# EAGLE design usb-serie (EAGLE 4.09)
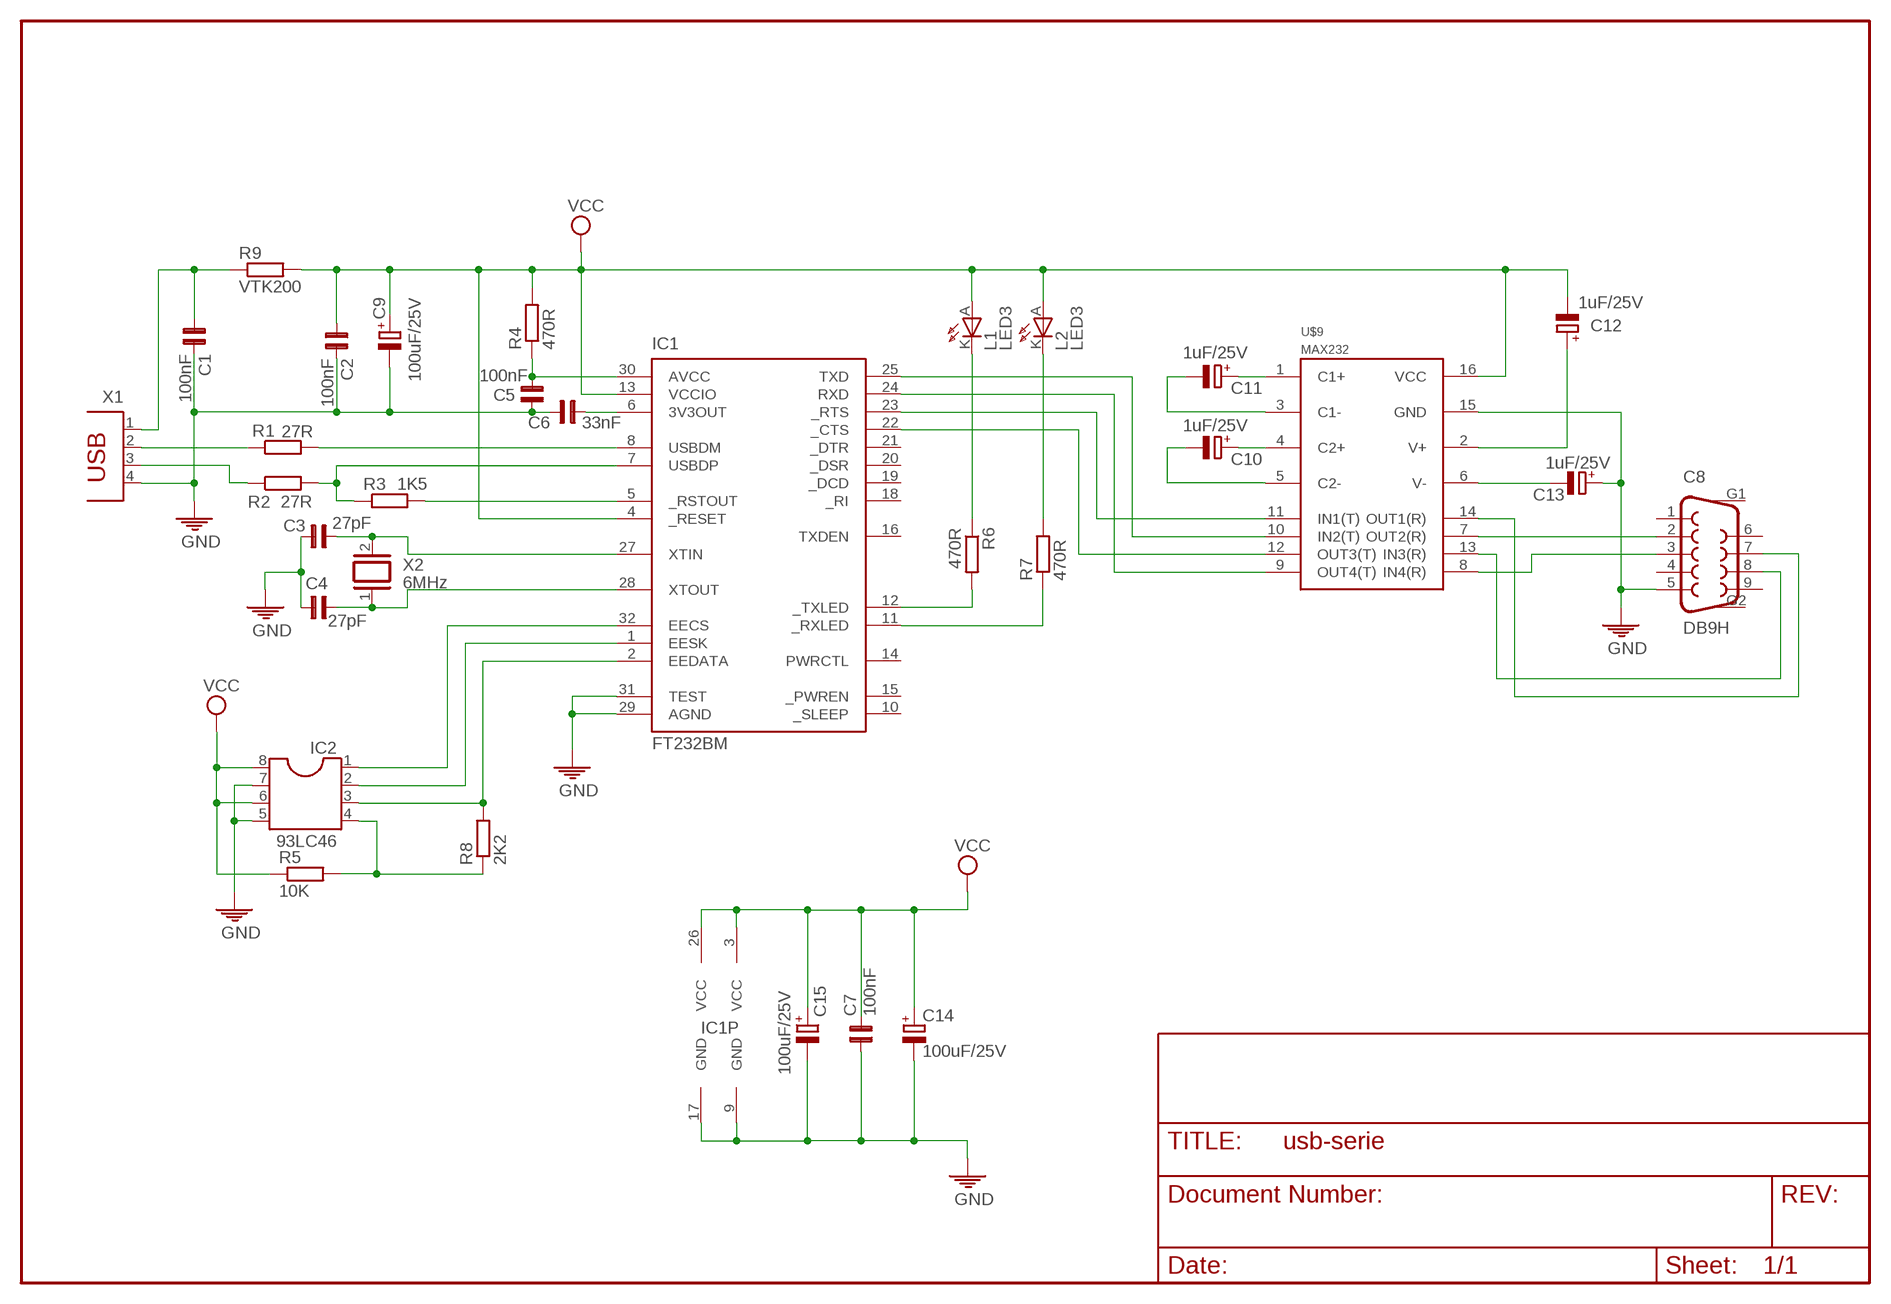
[diagram p0: schematic, sheet 1]

## Parts
C1  100nF  CON-MUL5  [C5]
C2  100nF  CON-MUL5  [C5]
C3  27pF  CON-MUL5  [C5]
C4  27pF  CON-MUL5  [C5]
C5  100nF  CON-MUL5  [C5]
C6  33nF  CON-MUL5  [C5]
C7  100nF  CON-MUL5  [C5]
C8  DB9H  [DB9H]
C9  100uF/25V  CPOL-EUE2.5-6  [E2,5-6]
C10  1uF/25V  CPOL-EUE2.5-6  [E2,5-6]
C11  1uF/25V  CPOL-EUE2.5-6  [E2,5-6]
C12  1uF/25V  CPOL-EUE2.5-6  [E2,5-6]
C13  1uF/25V  CPOL-EUE2.5-6  [E2,5-6]
C14  100uF/25V  CPOL-EUE2.5-6  [E2,5-6]
C15  100uF/25V  CPOL-EUE2.5-6  [E2,5-6]
IC1  FT232BM  [LQFP32]
IC2  93LC46  DIL8  [DIL08]
L1  LED3  [LED3MM]
L2  LED3  [LED3MM]
R1  27R  RESISTENCIA10  [R207/10]
R2  27R  RESISTENCIA10  [R207/10]
R3  1K5  RESISTENCIA10  [R207/10]
R4  470R  RESISTENCIA10  [R207/10]
R5  10K  RESISTENCIA10  [R207/10]
R6  470R  RESISTENCIA10  [R207/10]
R7  470R  RESISTENCIA10  [R207/10]
R8  2K2  RESISTENCIA10  [R207/10]
R9  VTK200  RESISTENCIA10  [R207/10]
U$9  MAX232SMD  [SMD16]
X1  PN87520  [PN87520]
X2  6MHz  XTALR  [XTAL-R]

## Nets
GND: C1.2 C2.2 C3.1 C4.1 C5.1 C6.2 C7.1 C8.5 C9.- C13.+ C14.- C15.- IC1.9(GND) IC1.17(GND) IC1.29(AGND) IC1.31(TEST) IC2.5 IC2.7 U$9.15(GND) X1.4
N$1: R1.1 X1.2
N$2: R2.1 X1.3
N$3: IC1.8(USBDM) R1.2
N$4: IC1.7(USBDP) R2.2 R3.1
N$5: IC1.5(_RSTOUT) R3.2
N$6: C1.1 R9.1 X1.1
N$7: L1.K(C) R6.1
N$8: L2.K(C) R7.2
N$9: IC1.24(RXD) U$9.9(OUT4(T))
N$10: IC1.12(_TXLED) R6.2
N$11: C4.2 IC1.28(XTOUT) X2.1
N$12: C3.2 IC1.27(XTIN) X2.2
N$13: IC1.11(_RXLED) R7.1
N$14: IC1.25(TXD) U$9.10(IN2(T))
N$15: IC1.23(_RTS) U$9.11(IN1(T))
N$16: IC1.22(_CTS) U$9.12(OUT3(T))
N$17: C6.1 IC1.6(3V3OUT)
N$18: C5.2 IC1.30(AVCC) R4.1
N$19: C11.+ U$9.1(C1+)
N$20: C10.+ U$9.4(C2+)
N$21: C11.- U$9.3(C1-)
N$22: C10.- U$9.5(C2-)
N$23: C12.+ U$9.2(V+)
N$24: IC1.32(EECS) IC2.1
N$25: C13.- U$9.6(V-)
N$26: C8.2 U$9.7(OUT2(R))
N$27: C8.3 U$9.8(IN4(R))
N$28: C8.8 U$9.13(IN3(R))
N$29: C8.7 U$9.14(OUT1(R))
N$30: IC1.1(EESK) IC2.2
N$31: IC1.2(EEDATA) IC2.3 R8.2
N$34: IC2.4 R5.2 R8.1
VCC: C2.1 C7.2 C9.+ C12.- C14.+ C15.+ IC1.3(VCC) IC1.4(_RESET) IC1.13(VCCIO) IC1.26(VCC) IC2.6 IC2.8 L1.A L2.A R4.2 R5.1 R9.2 U$9.16(VCC)
Unconnected: C8.1 C8.4 C8.6 C8.9 C8.G1 C8.G2 IC1.10(_SLEEP) IC1.14(PWRCTL) IC1.15(_PWREN) IC1.16(TXDEN) IC1.18(_RI) IC1.19(_DCD) IC1.20(_DSR) IC1.21(_DTR)

## Library data of the parts
C1-C7 = custom-2002:CON-MUL: Condensadores multicapa
C8 = custom-2002:DB9: Conectores Puerto Serie PC Conector visto de frente
C9-C15 = rcl:CPOL-EU: POLARIZED CAPACITOR, European symbol
IC1 = ftdi3:FT232BM: USB UART 2nd Generation USB UART (USB <-> Serial)
IC2 = dil:DIL8: SOCKET Dual In Line
L1 L2 = custom-2002:LED: Diodo LED Anodo positivo (pata larga)
R1-R9 = custom-2002:RESISTENCIA: Resistencia
U$9 = custom-2002:MAX232: CONVERSOR RS232 - TTL
X1 = con-berg:PN87520: BERG
X2 = custom-2002:XTAL: XTAL

## Board
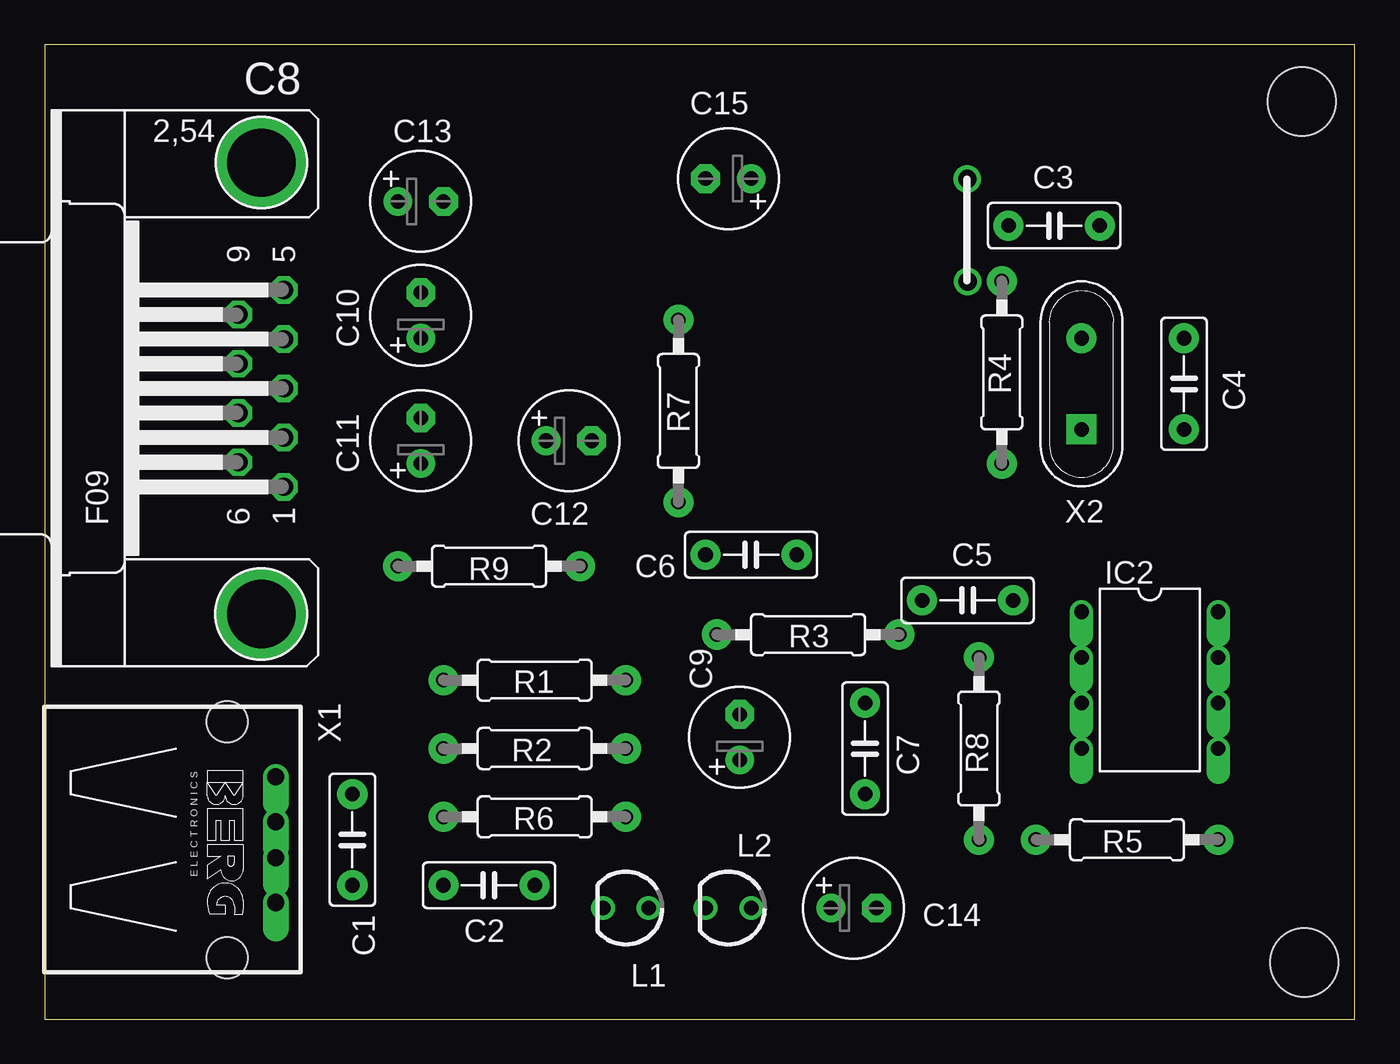
[diagram p1: board, top side]
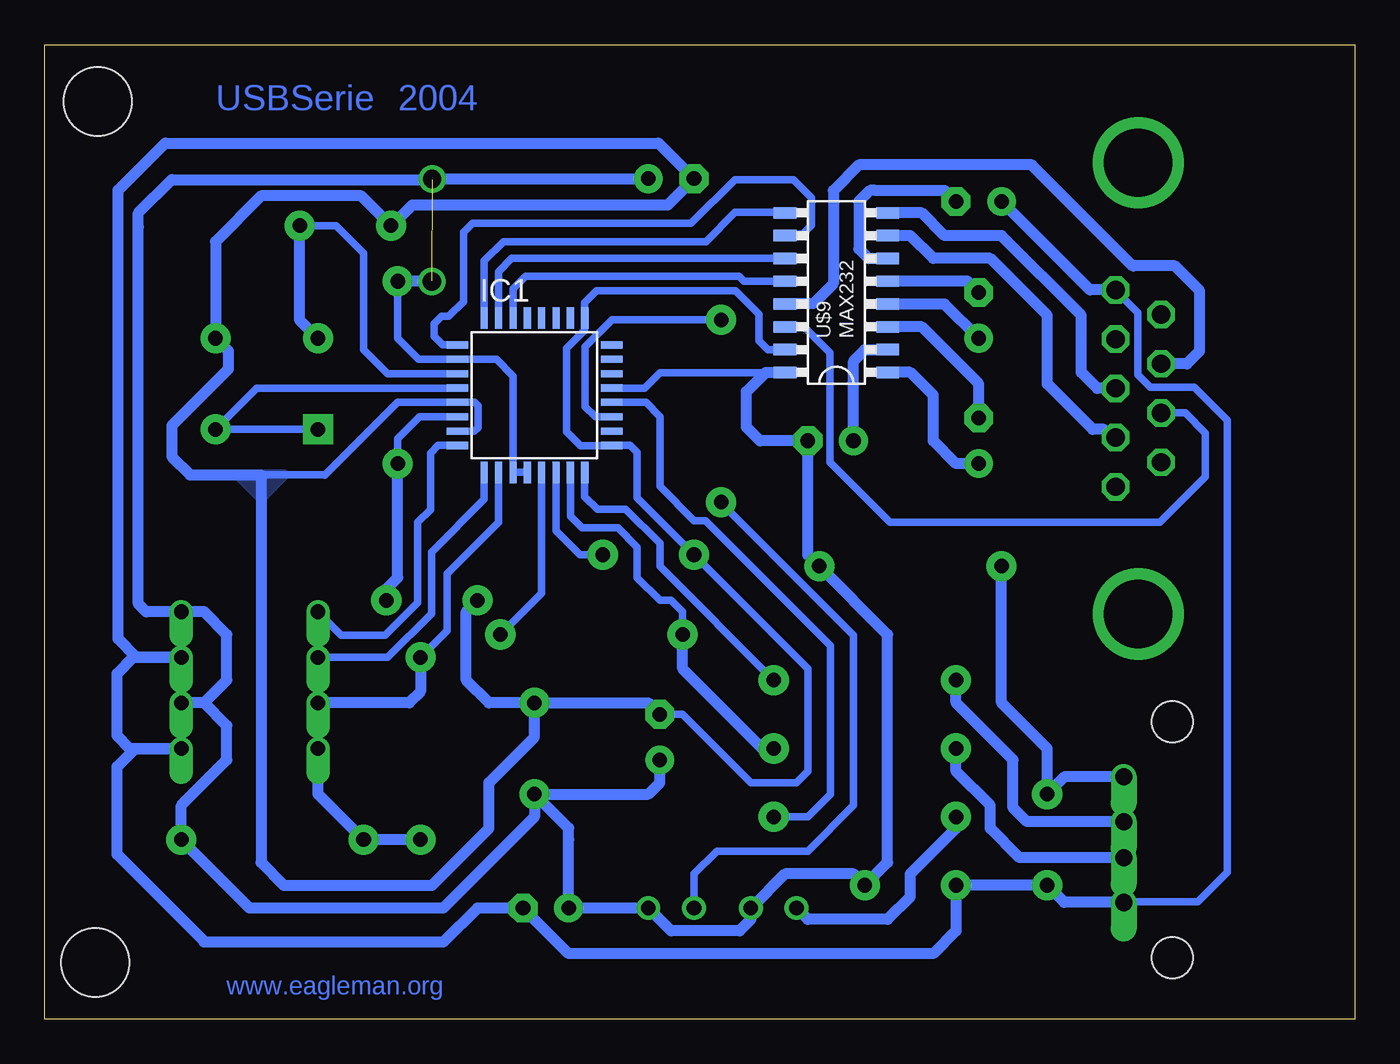
[diagram p2: board, bottom side, seen from below]

Size 73.01 x 54.28 mm. Coordinates in mm from the lower left corner, seen from the top.
Outline: 0,0 73.01,0 73.01,54.28 0,54.28 0,0
Copper layers used: Bottom
Holes 3.81 mm at 70.2,3.15 70.05,51.12

### Footprints (pad centres in the part's own frame; a part is rotated, then mirrored left to right if it is on the bottom)
C5 = drill 0.813 pad 1.676 round: 1 0,0; 2 5.08,0
DB9H = drill 1.016 octagon: 1 -0.025,0; 2 2.718,0; 3 5.461,0; 4 8.204,0; 5 10.947,0; 6 1.346,2.54; 7 4.089,2.54; 8 6.833,2.54; 9 9.576,2.54 | drill 3.81 pad 5.08 round: G1 -7.112,1.27; G2 18.034,1.27
E2,5-6 = drill 0.813 pad 1.6 round: + -1.27,0 | drill 0.813 pad 1.6 octagon: - 1.27,0
LQFP32 = smd 0.4 x 1.2: 1 -2.8,-4.3; 2 -2,-4.3; 3 -1.2,-4.3; 4 -0.4,-4.3; 5 0.4,-4.3; 6 1.2,-4.3; 7 2,-4.3; 8 2.8,-4.3; 17 2.8,4.3; 18 2,4.3; 19 1.2,4.3; 20 0.4,4.3; 21 -0.4,4.3; 22 -1.2,4.3; 23 -2,4.3; 24 -2.8,4.3 | smd 1.2 x 0.4: 9 4.3,-2.8; 10 4.3,-2; 11 4.3,-1.2; 12 4.3,-0.4; 13 4.3,0.4; 14 4.3,1.2; 15 4.3,2; 16 4.3,2.8; 25 -4.3,2.8; 26 -4.3,2; 27 -4.3,1.2; 28 -4.3,0.4; 29 -4.3,-0.4; 30 -4.3,-1.2; 31 -4.3,-2; 32 -4.3,-2.8
DIL08 = drill 0.813 offset: 1 -3.81,-3.81; 2 -1.27,-3.81; 3 1.27,-3.81; 4 3.81,-3.81; 5 3.81,3.81; 6 1.27,3.81; 7 -1.27,3.81; 8 -3.81,3.81
LED3MM = drill 0.813 round: A 0,0; K 2.54,0
R207/10 = drill 0.813 pad 1.676 round: 1 0,0; 2 10.16,0
SMD16 = smd 0.635 x 1.27: 1 -3.81,-2.54; 2 -2.54,-2.54; 3 -1.27,-2.54; 4 0,-2.54; 5 1.27,-2.54; 6 2.54,-2.54; 7 3.81,-2.54; 8 5.08,-2.54; 9 5.08,3.175; 10 3.81,3.175; 11 2.54,3.175; 12 1.27,3.175; 13 0,3.175; 14 -1.27,3.175; 15 -2.54,3.175; 16 -3.81,3.175
PN87520 = drill 0.95 offset: 1 -3.5,2.71; 2 -1,2.71; 3 1,2.71; 4 3.5,2.71 | hole 2.3: -6.57,0; 6.57,0
XTAL-R = drill 0.813 pad 1.676 square: 1 0,0 | drill 0.813 pad 1.676 round: 2 5.08,0

### Placement (x,y rotation side)
C1  17.14,12.54 270 top
C2  27.3,7.46 180 top
C3  53.72,44.21 0 top
C4  63.49,37.94 270 top
C5  48.89,23.33 0 top
C6  41.9,25.87 180 top
C7  45.71,17.62 270 top
C8  13.33,29.68 90 top
C9  38.73,15.71 90 top
C10  20.95,39.2 90 top
C11  20.95,32.22 90 top
C12  29.21,32.22 0 top
C13  20.95,45.55 0 top
C14  45.08,6.18 0 top
C15  38.09,46.83 180 top
IC1  45.71,34.76 0 bottom
IC2  61.59,18.89 270 top
L1  33.65,6.18 180 top
L2  39.36,6.18 180 top
R1  22.22,18.89 0 top
R2  22.22,15.08 0 top
R3  37.46,21.43 0 top
R4  53.34,30.95 90 top
R5  65.4,10 180 top
R6  22.22,11.27 0 top
R7  35.31,38.96 270 top
R8  52.06,10 90 top
R9  19.68,25.23 0 top
U$9  28.57,39.84 90 bottom
X1  10.15,10 270 top
X2  57.78,32.86 90 top

### Tracks (layer width: path | path; a pad name or v marks a point on that pad's centre or on a via)
GND
  Bottom 0.406: IC1.31 49.99,32.76 49.98,32.75 49.07,32.75 48.86,32.96 48.86,34.18 49.05,34.36 IC1.29 53.35,34.36 57.4,30.31 | 60.95,30.32 57.4,30.32 57.4,30.31 | C9.- 37.46,16.98 33.65,13.17 31.11,13.17 30.48,13.81 30.48,19.52 C6.2 40,29.05 40,31.59 40.38,31.96 IC1.9 41.45,31.96 41.46,31.95 43.15,31.95 43.92,32.72 43.92,37.37 42.91,38.37 42.91,38.38 | C8.5 13.33,40.6 12.08,39.36 12.08,35.9 11.37,35.19 8.94,35.19 7.11,33.36 7.11,8.17 8.73,6.54 12.8,6.54 12.84,6.5 X1.4 | 42.91,38.38 IC1.17 | 57.4,30.31 57.41,30.3 | 42.91,38.38 42.91,39.91 42.24,40.58 34.51,40.58 33.21,39.27 33.21,37.79 32.71,37.29 31.74,37.29 31.73,37.3 | 31.73,37.3 | 31.73,37.3 U$9.15
  Bottom 0.61: C9.- 39.36,17.62 C7.1 | X1.4 16.18,6.5 C1.2 C2.2 22.22,4.92 23.49,3.65 43.81,3.65 C14.- 48.89,6.18 50.79,4.28 64.13,4.28 64.11,4.3 68.98,9.18 68.98,14.06 67.97,15.08 IC2.5 68.27,15.08 68.98,15.79 68.98,19.24 68.07,20.16 IC2.7 | C8.5 14.75,40.63 C13.+ | C5.1 49.52,22.7 49.52,18.89 48.25,17.62 C7.1 | C7.1 45.71,15.71 48.25,13.17 48.25,10.63 51.43,7.46 59.68,7.46 60.95,8.73 60.95,30.32 64.92,30.32 65.93,31.33 65.93,33.06 62.78,36.21 62.78,37.22 C4.1 63.49,43.32 60.95,45.86 55.37,45.86 C3.1 53.66,44.21 52.52,45.35 38.3,45.35 C15.- 38.81,48.81 66.29,48.81 68.92,46.18 68.92,45.29 | IC2.7 65.32,20.16 | 65.38,20.17 | IC2.7 65.38,20.17 | 65.38,20.17 67.91,20.17 67.91,20.16 | 68.92,45.29 | 68.92,45.29 68.93,45.3 68.93,21.18 67.91,20.16 | 67.91,20.16
  pour Bottom: 62.22,30.32 59.68,30.32 60.95,29.05
N$1
  Bottom 0.61: X1.2 18.27,11 19.05,11.77 19.05,14.44 22.22,17.62 R1.1
N$2
  Bottom 0.61: X1.3 18.68,9 20.32,10.63 20.32,11.9 22.22,13.81 R2.1
N$3
  Bottom 0.406: IC1.8 42.91,29.12 42.21,28.41 40.63,28.41 38.73,26.51 38.73,25.23 R1.2
N$4
  Bottom 0.406: IC1.7 43.71,28.01 43.07,27.37 41.07,27.37 40,26.3 40,24.6 38.73,23.33 38.09,23.33 37.46,22.7 R3.1
  Bottom 0.61: R2.2 33.02,15.08 37.46,19.52 R3.1
N$5
  Bottom 0.406: IC1.5 45.31,23.73 R3.2
N$6
  Bottom 0.61: X1.1 16.18,13.5 C1.1 17.14,15.08 19.68,17.62 R9.1
N$7
  Bottom 0.61: R6.1 22.22,10.63 24.76,8.09 24.76,6.82 26.03,5.55 30.48,5.55 L1.K
N$8
  Bottom 0.406: L2.K 36.82,8.09 35.55,9.36 30.48,9.36 27.94,11.9 27.94,21.39 35.34,28.8 R7.2
N$9
  Bottom 0.406: IC1.24 48.52,42.25 47.44,43.32 36.16,43.32 34.54,44.95 31.69,44.95 31.72,44.92 U$9.9
N$10
  Bottom 0.406: R6.2 30.48,11.27 29.21,12.54 29.21,20.79 36.19,27.78 36.82,27.78 38.73,29.68 38.7,29.71 38.7,33.57 39.5,34.36 IC1.12
N$11
  Bottom 0.406: IC1.28 61.19,35.16 C4.2 X2.1
N$12
  Bottom 0.406: IC1.27 53.9,35.96 55.24,37.3 55.24,42.67 56.77,44.2 58.81,44.2 58.81,44.21 C3.2
  Bottom 0.61: C3.2 58.82,44.18 58.82,38.98 X2.2
N$13
  Bottom 0.406: IC1.11 42.32,33.56 42.88,34.13 42.88,37.46 41.39,38.95 35.32,38.95 R7.1 | R7.1 | R7.1
N$14
  Bottom 0.406: IC1.25 50.83,37.56 51.3,38.04 51.3,38.75 50.9,39.15 50.49,39.15 49.68,39.97 49.68,43.83 49.17,44.34 36.98,44.34 34.54,46.77 31.29,46.77 30.27,45.76 30.27,44.23 30.78,43.73 31.69,43.73 31.75,43.68 U$9.10
N$15
  Bottom 0.406: IC1.23 47.71,41.65 46.98,42.38 U$9.11
N$16
  Bottom 0.406: U$9.12 34.03,41.11 34.32,41.4 46.21,41.4 46.91,40.69 IC1.22
N$17
  Bottom 0.406: IC1.6 44.52,27.21 43.17,25.87 C6.1
N$18
  Bottom 0.406: IC1.30 52.12,33.56 53.34,32.35 53.34,30.93
  Bottom 0.61: C5.2 53.97,23.96 53.34,24.6 53.34,30.93 R4.1
N$19
  Bottom 0.61: U$9.1 24.76,36.03 23.49,34.76 23.49,32.22 22.22,30.95 C11.+
N$20
  Bottom 0.61: U$9.4 22.86,39.84 C10.+
N$21
  Bottom 0.61: U$9.3 24.12,38.57 20.95,35.4 C11.-
N$22
  Bottom 0.61: U$9.5 21.59,41.11 C10.-
N$23
  Bottom 0.61: U$9.2 27.3,37.3 27.94,36.66 C12.+
N$24
  Bottom 0.406: IC1.32 51.08,31.96 51.51,31.53 51.51,28.39 52.22,27.67 52.22,23.2 54.05,21.37 56.48,21.37 57.78,22.67 IC2.1
N$25
  Bottom 0.406: C13.- 22.25,45.55
  Bottom 0.61: 22.25,45.55 22.86,46.16 26.72,46.16 26.71,46.18 | U$9.6 27.1,42.38 27.63,42.91 27.63,45.55 27.01,46.18 26.71,46.18 | 26.71,46.18 26.7,46.18
N$26
  Bottom 0.61: U$9.7 24.76,43.65 23.49,42.38 20.32,42.38 17.14,39.2 17.14,35.4 14.6,32.86 13.96,32.86 13.33,32.22 C8.2
N$27
  Bottom 0.61: C8.3 14.35,35.14 15.23,36.03 15.23,39.2 19.68,43.65 22.86,43.65 24.12,44.92 U$9.8
N$28
  Bottom 0.61: C8.8 9.34,36.51 8.63,37.22 8.63,40.58 10.02,41.97 12.32,41.97 12.32,41.96 12.32,41.95 12.36,41.95 17.98,47.57 17.98,47.59 27.63,47.59 29.05,46.16 29.05,40.98 30.17,39.87 31.77,39.87 | 31.77,39.87 31.8,39.87 | 31.77,39.87 U$9.13
N$29
  Bottom 0.406: U$9.14 30.7,38.57 29.26,37.12 29.26,31.03 25.9,27.67 10.87,27.67 8.33,30.21 8.33,32.65 9.44,33.77 C8.7
N$30
  Bottom 0.406: IC1.1 48.52,28.96 51.45,26.02 51.45,22.59 53.89,20.16 IC2.2
N$31
  Bottom 0.406: IC1.2 47.71,27.68 50.59,24.8 50.59,21.63 R8.2
  Bottom 0.61: IC2.3 52.7,17.62 52.06,18.25 R8.2
N$34
  Bottom 0.61: R8.1 R5.2 57.78,12.54 IC2.4
VCC  (via drill 1.02)  (1 unrouted)
  Bottom 0.406: IC1.3 IC1.4 | R4.2 53.34,37.94 52.16,36.76 IC1.26 47.83,36.76 46.9,35.83 46.9,30.42 46.91,30.42 IC1.3 | IC1.3 | U$9.16 31.83,36.03 31.85,36.01 38.72,36.01 39.57,35.16 IC1.13 | v51.41,46.81 v51.4,46.8 51.4,46.77 | v51.41,46.81 v51.41,46.8 | v51.41,46.81 51.48,46.88
  Bottom 0.61: 64.13,17.62 62.86,18.89 62.86,21.43 64.13,22.7 IC2.8 67.36,22.7 67.36,22.69 | 64.13,17.62 IC2.6 | 64.13,17.62 62.86,16.35 62.86,14.44 65.4,11.9 R5.1 61.59,6.18 50.79,6.18 45.71,11.27 C7.2 | C9.+ 38.73,13.17 39.36,12.54 C7.2 | C15.+ | C15.+ 51.42,46.82 51.42,46.83 | C15.+ 39.31,46.88 | 51.42,46.83 51.41,46.82 v51.41,46.8 | 51.42,46.83 51.44,46.84 | 53.35,41.14 53.34,41.13 R4.2 | 53.35,41.14 51.41,41.14 51.41,41.13 v51.45,41.1 | 53.35,41.14 | v51.45,41.1 v51.44,41.1 | v51.45,41.1 v51.45,41.09 | 51.4,46.77 65.93,46.77 67.79,44.92 67.79,44.14 67.8,44.13 67.8,23.13 67.36,22.69 | 67.36,22.69 67.35,22.68 | C7.2 43.81,10.64 43.81,10 C14.+ L2.A 38.09,4.92 34.28,4.92 33.65,5.55 L1.A 31.75,8.09 27.94,8.09 C2.1 26.03,8.73 26.03,21.43 R9.2 30.48,25.87 C12.- 30.49,32.23 30.51,32.22 33.14,32.22 33.9,32.98 33.9,34.96 32.82,36.04 U$9.16

### Text on the board
Bottom: 2004 | USBSerie | www.eagleman.org